# EAGLE design graphiclcd (EAGLE 4.16)
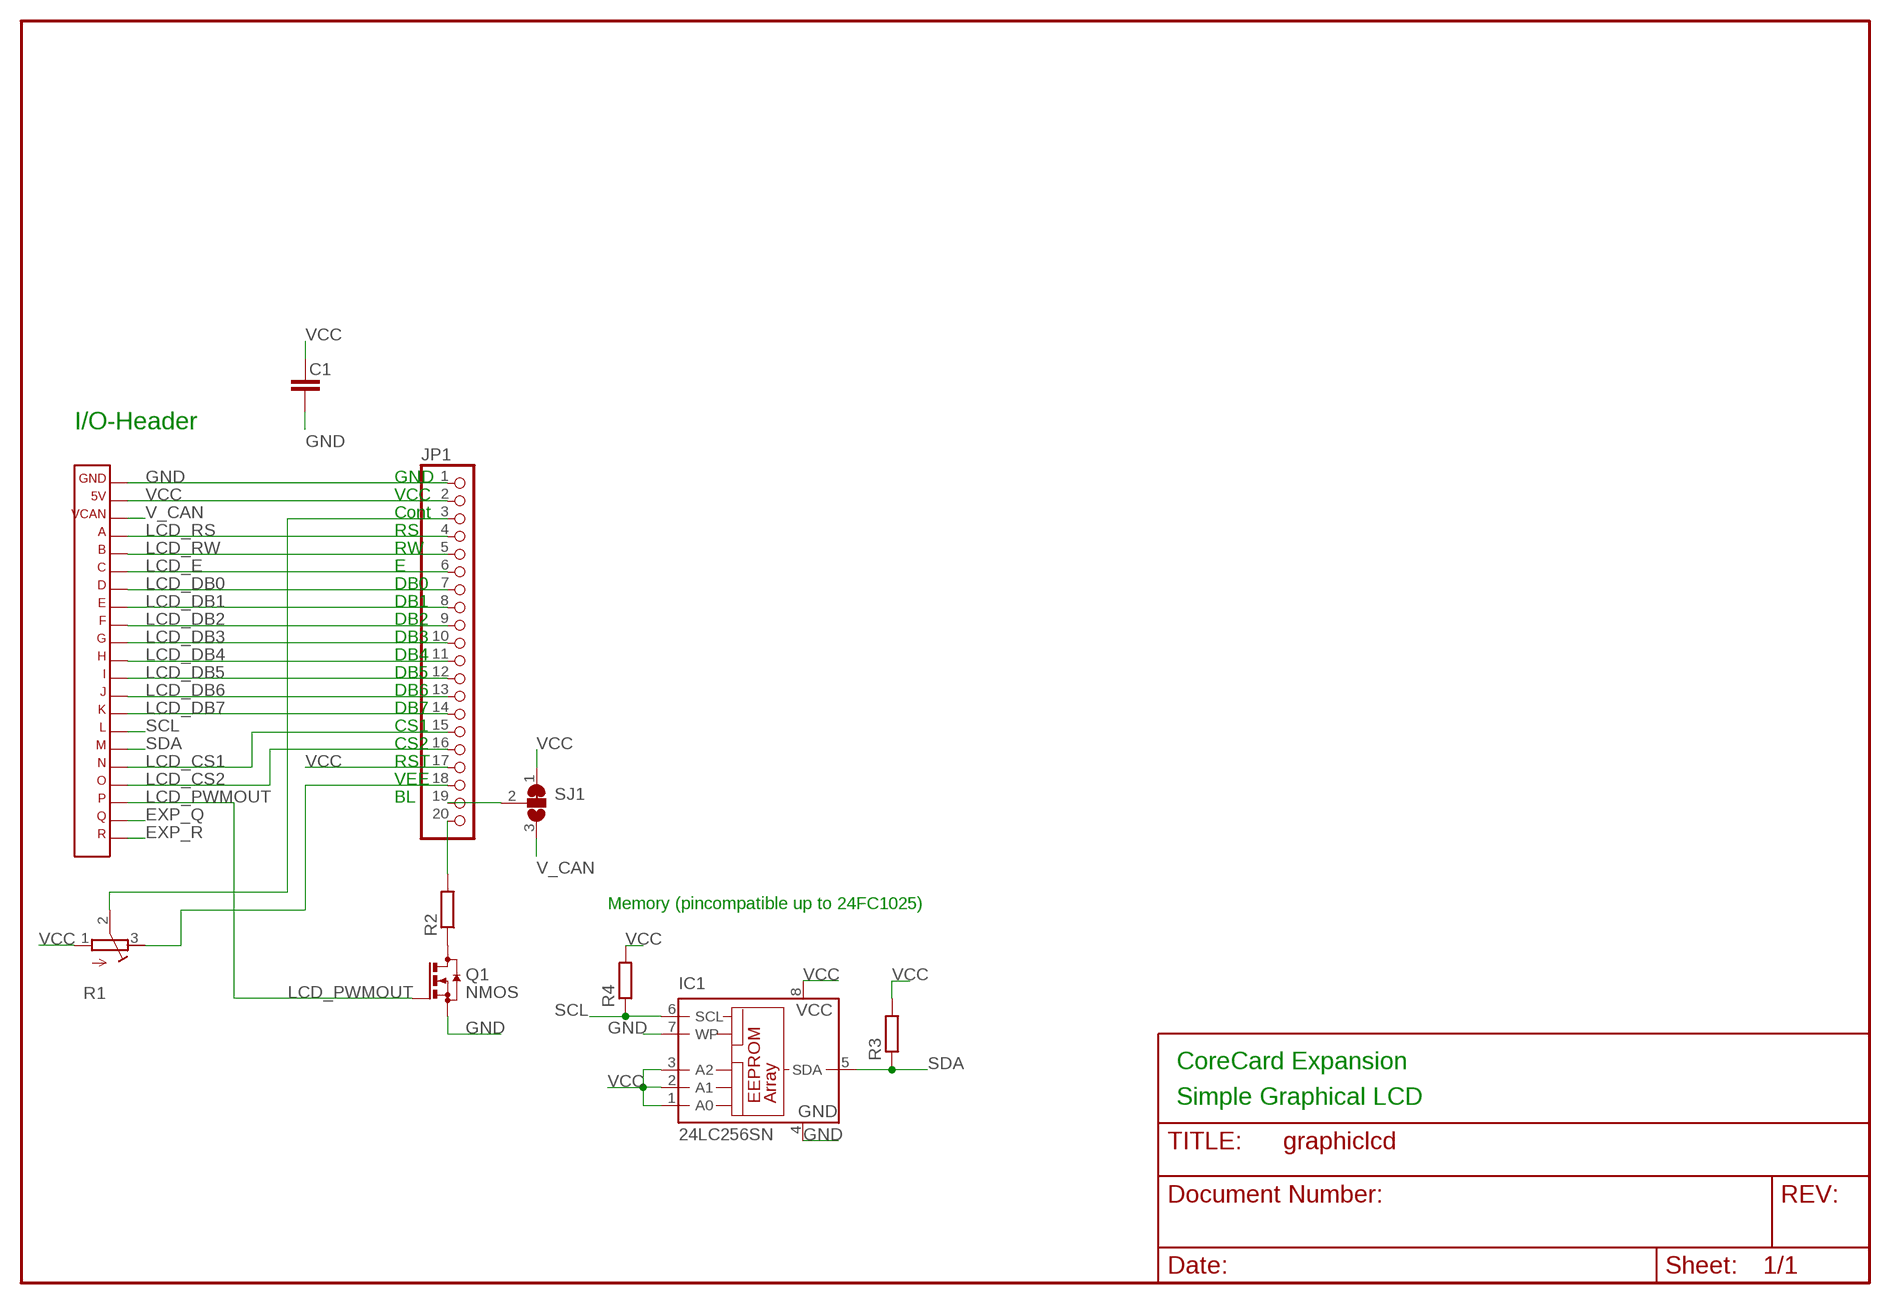
[diagram p0: schematic, sheet 1]

## Parts
C1  C-EUC0603  [C0603]
IC1  24LC256SN  [SO-08]
JP1  PINHD-2X10  [2X10]
Q1  NMOS  [SOT23]
R1  R-TRIM  [TRIM_PVZ3]
R2  R-EU_0207/15  [0207/15]
R3  R-EUR0603  [R0603]
R4  R-EUR0603  [R0603]
SJ1  SJ_2_NO_NCSMALL  [SJ_2_NO_NC_SMALL]
X3  CORE_IOHEADEXP  [CORE_IOHEAD_NOSILC]

## Nets
BL_PWR: JP1.19 SJ1.2
EXP_Q: X3.20
EXP_R: X3.21
GND: C1.2 IC1.4(GND) IC1.7(WP) JP1.1 Q1.2(S) X3.1
LCD_CONTRAST: JP1.3 R1.2(PAD2)
LCD_CS1: JP1.15 X3.17
LCD_CS2: JP1.16 X3.18
LCD_DB0: JP1.7 X3.7
LCD_DB1: JP1.8 X3.8
LCD_DB2: JP1.9 X3.9
LCD_DB3: JP1.10 X3.10
LCD_DB4: JP1.11 X3.11
LCD_DB5: JP1.12 X3.12
LCD_DB6: JP1.13 X3.13
LCD_DB7: JP1.14 X3.14
LCD_E: JP1.6 X3.6
LCD_PWMOUT: Q1.1(G) X3.19
LCD_RS: JP1.4 X3.4
LCD_RW: JP1.5 X3.5
LCD_VEE: JP1.18 R1.3(PAD3)
N$1: Q1.3(D) R2.1
N$4: JP1.20 R2.2
SCL: IC1.6(SCL) R4.1 X3.15
SDA: IC1.5(SDA) R3.1 X3.16
V_CAN: SJ1.3 X3.3
VCC: C1.1 IC1.1(A0) IC1.2(A1) IC1.3(A2) IC1.8(VCC) JP1.2 JP1.17 R1.1(PAD1) R3.2 R4.2 SJ1.1 X3.2

## Notes on the sheet
- I/O-Header
- GND
- VCC
- Cont
- RS
- RW
- E
- DB0
- DB1
- DB2
- DB3
- DB4
- DB5
- DB6
- DB7
- CS1
- CS2
- RST
- VEE
- BL
- Memory (pincompatible up to 24FC1025)
- CoreCard Expansion
- Simple Graphical LCD

## Library data of the parts
C1 = rcl:C-EU
IC1 = microchip:24*: Serial EEPROM I2C
JP1 = pinhead-mm:PINHD-2X10
Q1 = transistor:NMOS
R1 = rcl:R-TRIM
R2 = rcl:R-EU_: RESISTOR, European symbol
R3 R4 = rcl:R-EU
SJ1 = jumper:SJ_2_NO_NC
X3 = expboard:CORE_IOHEAD: CoreCard IO-header for expansion cards

## Board
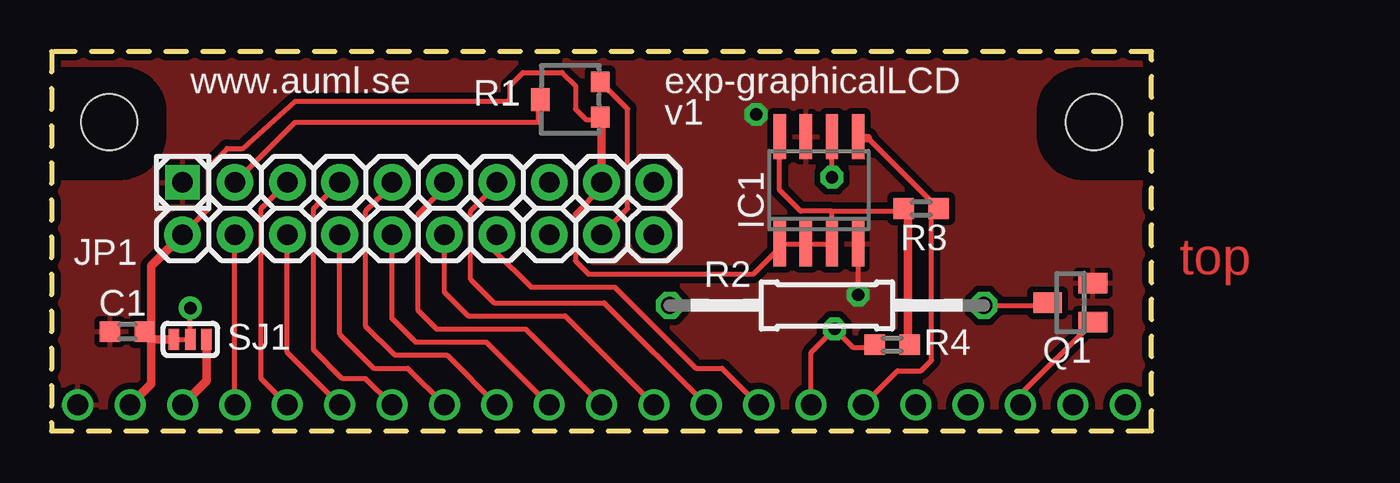
[diagram p1: board, top side]
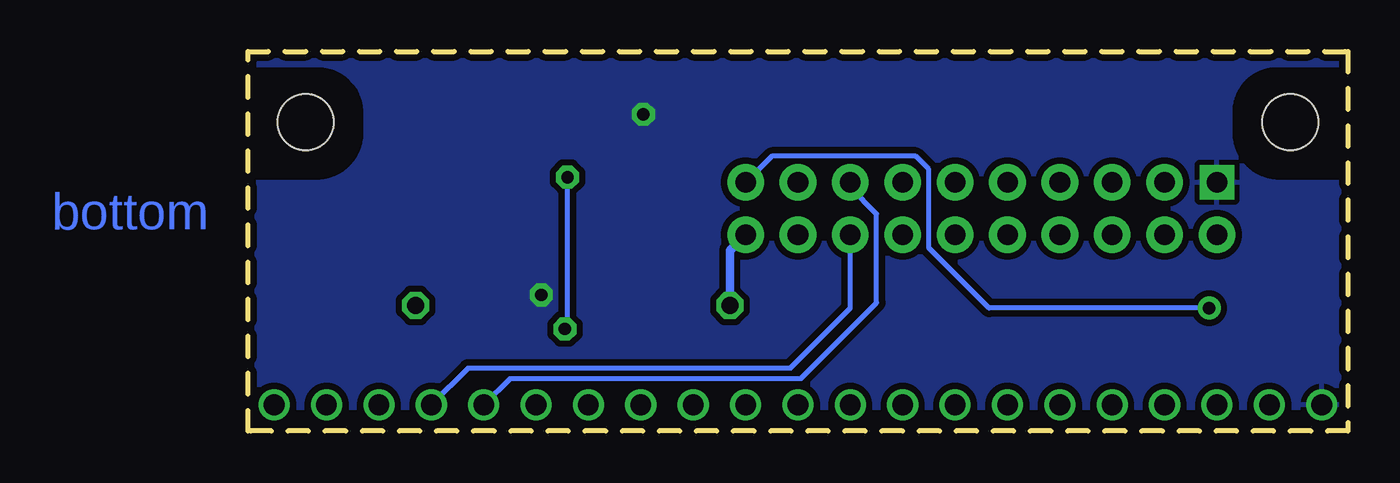
[diagram p2: board, bottom side, seen from below]

Size 53.34 x 18.41 mm. Coordinates in mm from the lower left corner, seen from the top.
Outline: 0,0 53.34,0 53.34,18.41 0,18.41 0,0
Copper layers (1*16): Top 0.035mm / dielectric 1.5mm / Bottom 0.035mm
Design rules "default": minimum track width 10mil, minimum drill 0.6mm, track to track 10mil, track to pad 10mil, pad to pad 10mil, via to via 10mil, smd to smd 8mil, copper to edge 10mil, drill to drill 8mil, minimum pad ring 10mil, minimum via ring 10mil, stop-mask expansion 4mil, vias tented up to drill 0mil, thermal gap 10mil
Holes 2.7 mm at 50.55,14.99 2.79,14.99

### Footprints (pad centres in the part's own frame; a part is rotated, then mirrored left to right if it is on the bottom)
C0603 = smd 1 x 1: 1 -0.85,0; 2 0.85,0
SO-08 = smd 0.6 x 2.2: 1 -1.905,-2.6; 2 -0.635,-2.6; 3 0.635,-2.6; 4 1.905,-2.6; 5 1.905,2.6; 6 0.635,2.6; 7 -0.635,2.6; 8 -1.905,2.6
2X10 = drill 1 pad 1.676 square: 1 -10.16,1.27 | drill 1 pad 1.778 round: 2 -10.16,-1.27; 3 -7.62,1.27; 4 -7.62,-1.27; 5 -5.08,1.27; 6 -5.08,-1.27; 7 -2.54,1.27; 8 -2.54,-1.27; 9 0,1.27; 10 0,-1.27; 11 2.54,1.27; 12 2.54,-1.27; 13 5.08,1.27; 14 5.08,-1.27; 15 7.62,1.27; 16 7.62,-1.27; 17 10.16,1.27; 18 10.16,-1.27; 19 12.7,1.27; 20 12.7,-1.27
SOT23 = smd 1 x 1.4: 1 -0.95,-1.1; 2 0.95,-1.1; 3 0,1.1
TRIM_PVZ3 = smd 1 x 0.9: 1 0.5,0.45; 3 2.2,0.45 | smd 1.1 x 0.9: 2 1.35,3.35
0207/15 = drill 0.813 octagon: 1 -7.62,0; 2 7.62,0
R0603 = smd 0.991 x 1.016: 1 -0.85,0; 2 0.85,0
SJ_2_NO_NC_SMALL = smd 0.508 x 1.016: 1 -0.787,0; 2 0,0; 3 0.787,0
CORE_IOHEAD_NOSILC = drill 1 round: 1 25.4,0; 2 22.86,0; 3 20.32,0; 4 17.78,0; 5 15.24,0; 6 12.7,0; 7 10.16,0; 8 7.62,0; 9 5.08,0; 10 2.54,0; 11 0,0; 12 -2.54,0; 13 -5.08,0; 14 -7.62,0; 15 -10.16,0; 16 -12.7,0; 17 -15.24,0; 18 -17.78,0; 19 -20.32,0; 20 -22.86,0; 21 -25.4,0

### Placement (x,y rotation side)
C1  3.68,4.83 180 top
IC1  37.21,11.68 0 top
JP1  16.51,10.79 0 top
Q1  49.4,6.22 90 top
R1  27.05,14.73 90 top
R2  37.59,6.1 180 top
R3  42.16,10.79 180 top
R4  40.77,4.19 0 top
SJ1  6.73,4.45 0 top
X3  26.67,1.27 0 bottom

### Tracks (layer width: path | path; a pad name or v marks a point on that pad's centre or on a via)
BL_PWR  (via drill 0.6)
  Top 0.254: SJ1.2 v6.73,5.97
  Bottom 0.254: 29.21,11.94 JP1.19 27.94,13.34 20.95,13.34 20.32,12.7 20.32,8.89 17.4,5.97 v6.73,5.97
GND  (via drill 0.6)
  Top 0.254: v39.12,6.6 IC1.4
  Bottom 0.254: v39.12,6.6 38.86,6.73
  other vias: 34.16,15.37
  pour Bottom (isolate 0.305, rank 3): 0,18.41 53.34,18.41 53.34,17.78 50.04,17.78 arc90 47.62,15.49 47.62,14.48 arc90 50.04,12.06 53.34,12.06 53.34,1.14 0,1.14 0,12.06 3.3,12.06 arc90 5.71,14.48 5.71,15.49 arc90 3.43,17.78 0,17.78
  pour Top (isolate 0.305, rank 3): 0,18.41 53.34,18.41 53.34,17.78 50.04,17.78 arc90 47.62,15.49 47.62,14.48 arc90 50.04,12.06 53.34,12.06 53.34,1.14 0,1.14 0,12.06 3.3,12.06 arc90 5.71,14.48 5.71,15.49 arc90 3.43,17.78 0,17.78
LCD_CONTRAST
  Top 0.254: JP1.3 11.81,14.99 23.62,14.99 23.62,15.87 23.75,16 23.7,16.05 R1.2
LCD_CS1
  Bottom 0.254: JP1.15 24.13,11.81 22.86,10.54 22.86,6.22 26.54,2.54 40.64,2.54 X3.17
LCD_CS2
  Bottom 0.254: JP1.16 24.13,5.97 27.05,3.05 42.67,3.05 X3.18
LCD_DB0
  Top 0.254: JP1.7 12.7,10.79 12.7,3.94 14.1,2.54 15.24,2.54 X3.7
LCD_DB1
  Top 0.254: X3.8 17.27,3.05 15.62,3.05 13.97,4.7 JP1.8
LCD_DB2
  Top 0.254: JP1.9 16.51,11.94 15.24,10.67 15.24,5.08 16.64,3.68 19.18,3.68 X3.9
LCD_DB3
  Top 0.254: X3.10 21.08,4.32 17.65,4.32 16.51,5.46 JP1.10
LCD_DB4
  Top 0.254: X3.11 22.99,4.95 18.67,4.95 17.78,5.84 17.78,10.54 19.05,11.81 JP1.11
LCD_DB5
  Top 0.254: X3.12 24.89,5.59 20.19,5.59 19.05,6.73 JP1.12
LCD_DB6
  Top 0.254: X3.13 26.8,6.22 21.46,6.22 20.32,7.37 20.32,10.67 21.59,11.94 21.72,11.94 JP1.13
LCD_DB7
  Top 0.254: X3.14 32.51,3.05 31.24,3.05 27.3,6.99 23.24,6.99 21.46,8.76 21.46,9.53 JP1.14
LCD_E
  Top 0.254: 14.1,1.14 X3.6 11.43,3.81 JP1.6
LCD_PWMOUT
  Top 0.254: Q1.1 50.48,5.27 46.99,1.78 X3.19
LCD_RS
  Top 0.254: 8.89,1.14 X3.4 JP1.4
LCD_RW
  Top 0.254: X3.5 10.16,2.54 10.16,10.79 JP1.5
LCD_VEE
  Top 0.254: JP1.18 27.94,10.79 27.94,15.62 26.63,16.93 R1.3
N$1
  Top 0.254: Q1.3 48.26,6.22 48.13,6.1 R2.1
N$4
  Top 0.254: JP1.20 29.21,9.4
  Bottom 0.406: R2.2 29.97,8.76 JP1.20
SCL  (via drill 0.6)
  Top 0.254: v37.85,12.32 IC1.6 | R4.1 39.62,4.06 38.86,4.06 v37.97,4.95 36.83,3.81 X3.15
  Bottom 0.254: v37.85,12.32 37.85,5.08 v37.97,4.95
SDA
  Top 0.254: 39.59,14.22 R3.1 42.67,10.79 42.67,3.43 42.16,2.92 41.02,2.92 X3.16
  Top 0.406: IC1.5 39.12,14.22 39.59,14.22
V_CAN
  Top 0.406: SJ1.3 7.52,2.44 X3.3
VCC
  Top 0.254: 4.83,4.45 4.83,5.08 4.7,4.95 C1.1 | JP1.17 26.67,15.11 26.6,15.18 R1.1 26.6,15.17 26.54,15.11 25.91,15.11 25.4,15.62 25.4,16.76 24.77,17.4 22.86,17.4 22.23,16.76 22.23,16.13 22.1,16 11.81,16 9.27,13.72 8.51,13.72 7.62,12.83 7.62,10.79 JP1.2 | IC1.1 IC1.2 IC1.3 37.85,10.67 | 26.67,11.81 25.4,10.54 25.4,8.26 26.04,7.62 34.04,7.62 35.31,8.89 | 37.85,10.67 41.15,10.67 | 37.85,10.67 36.32,10.67 35.31,11.68 IC1.8
  Top 0.406: X3.2 4.83,2.29 4.83,4.45 | 4.83,5.08 4.83,8 JP1.2 | R3.2 41.4,10.79 | IC1.2 36.58,9.14 | 35.31,9.14 IC1.1 35.31,8.89 | 41.15,10.67 R3.2 | 26.67,15.11 26.67,11.81 | R3.2 41.44,10.67 41.53,10.67 41.53,4.41 R4.2 | 4.83,4.45 4.53,4.74 C1.1 | 4.83,4.45 SJ1.1

### Text on the board
Top: top
Bottom: bottom
tPlace: www.auml.se | exp-graphicalLCD | v1
tStop: top
bStop: bottom
Document: Top is component side | Expansion will be mounted bottom to bottom with CoreCard | Change vertical dimension to fit | Remove I/O-header silcscreen if neccesary | Remove mounting holes if neccesary
tDocu: IDC connector mounted on bottom side!